# Altium schematic sheet ActiTouch_Receiver_Sheet1.SchDoc
size A4; SheetNumber: 5; SheetTotal: 6
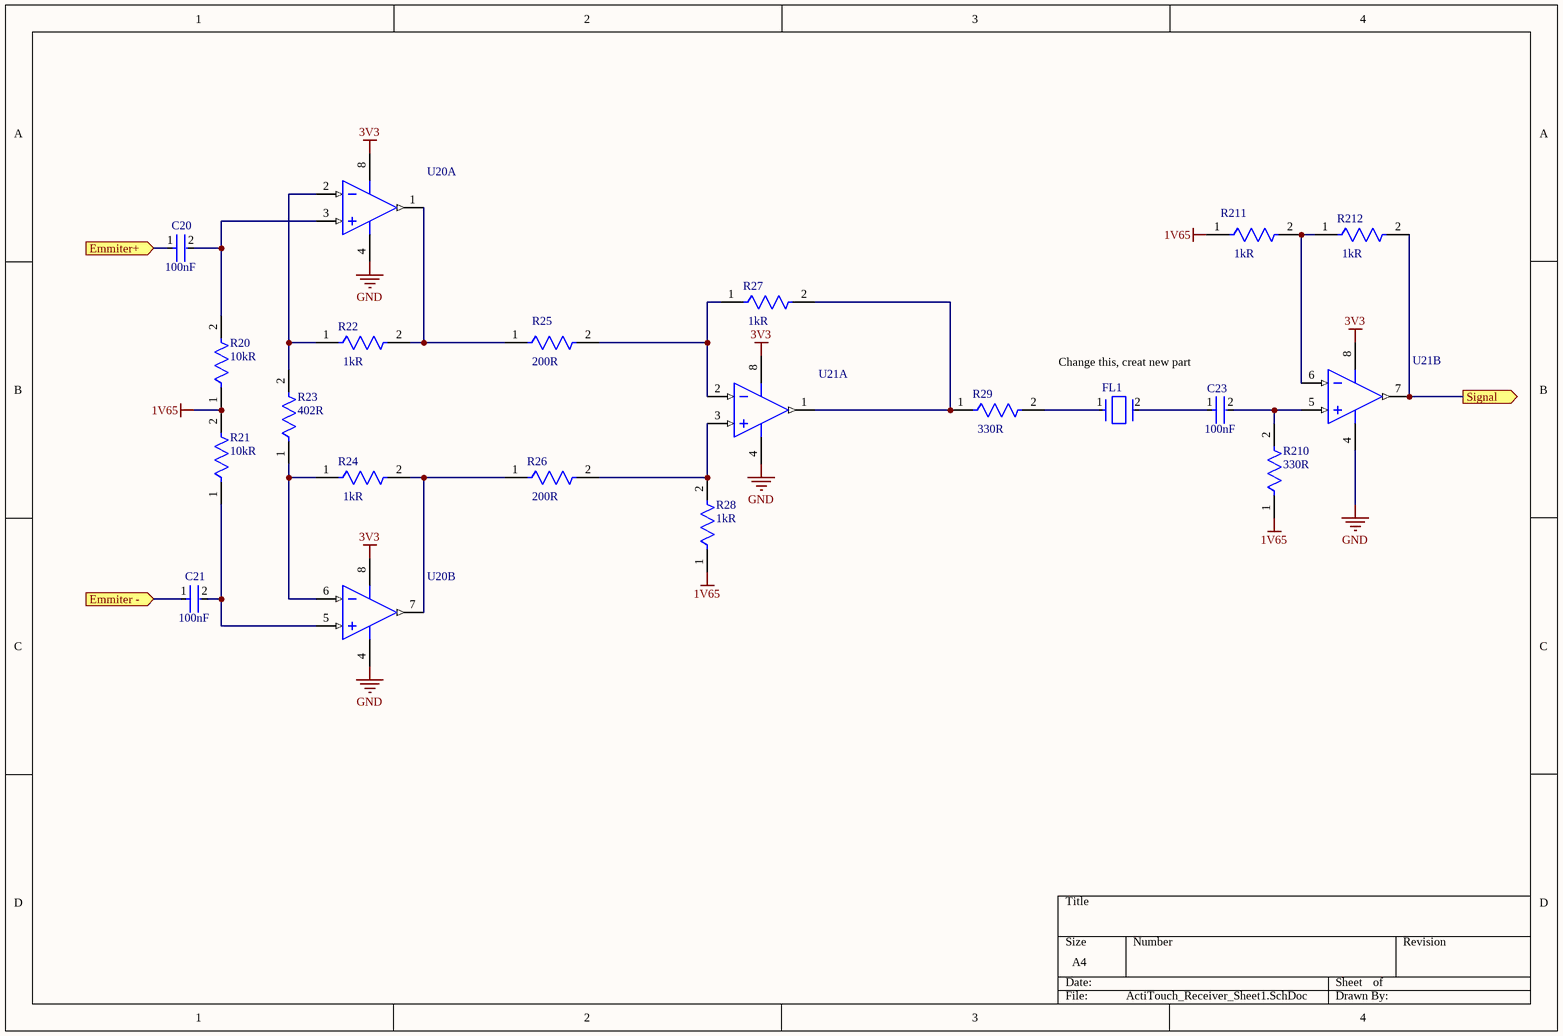
[diagram p0: ActiTouch_Receiver_Sheet1.SchDoc]

## Parts
C20  Capacitance: 100nF  [FP-0603-L_1_6_0_1-W_0_8_0-IPC_B]  (hidden comment: EMK107B7104KAHT)
C21  Capacitance: 100nF  [FP-0603-L_1_6_0_1-W_0_8_0-IPC_B]  (hidden comment: EMK107B7104KAHT)
C23  Capacitance: 100nF  [FP-0603-L_1_6_0_1-W_0_8_0-IPC_B]  (hidden comment: EMK107B7104KAHT)
FL1  CDSCB10M7GA121-R0  [FP-CDSCB10M7GA121-R0-MFG]  (value not drawn)
R20  Resistance: 10kR  [FP-RNCP0603-MFG]  (hidden comment: RNCP0603FTD10R0)
R21  Resistance: 10kR  [FP-RNCP0603-MFG]  (hidden comment: RNCP0603FTD10R0)
R22  Resistance: 1kR  [FP-RNCP0603-MFG]  (hidden comment: RNCP0603FTD10R0)
R23  Resistance: 402R  [FP-RNCP0603-MFG]  (hidden comment: RNCP0603FTD10R0)
R24  Resistance: 1kR  [FP-RNCP0603-MFG]  (hidden comment: RNCP0603FTD10R0)
R25  Resistance: 200R  [FP-RNCP0603-MFG]  (hidden comment: RNCP0603FTD10R0)
R26  Resistance: 200R  [FP-RNCP0603-MFG]  (hidden comment: RNCP0603FTD10R0)
R27  Resistance: 1kR  [FP-RNCP0603-MFG]  (hidden comment: RNCP0603FTD10R0)
R28  Resistance: 1kR  [FP-RNCP0603-MFG]  (hidden comment: RNCP0603FTD10R0)
R29  Resistance: 330R  [FP-RNCP0603-MFG]  (hidden comment: RNCP0603FTD10R0)
R210  Resistance: 330R  [FP-RNCP0603-MFG]  (hidden comment: RNCP0603FTD10R0)
R211  Resistance: 1kR  [FP-RNCP0603-MFG]  (hidden comment: RNCP0603FTD10R0)
R212  Resistance: 1kR  [FP-RNCP0603-MFG]  (hidden comment: RNCP0603FTD10R0)
U20  OPA2836IDR  [D0008A_M]  (value not drawn)  (parts A,B of 2)
U21  OPA2836IDR  [D0008A_M]  (value not drawn)  (parts A,B of 2)

## Ports
Emmiter - (in), Emmiter+ (in), Signal (out)

## Nets
1V65: R20.1 R21.2 R28.1 R210.1 R211.1
3V3: U20.8(VS+) U21.8(VS+)
GND: U20.4(VS-) U21.4(VS-)
Emmiter -: C21.1 ; port Emmiter -
Emmiter+: C20.1 ; port Emmiter+
Signal: R212.2 U21.7(VOUT2) ; port Signal
NetC20_2: C20.2 R20.2 U20.3(VIN1+)
NetC21_2: C21.2 R21.1 U20.5(VIN2+)
NetC23_1: C23.1 FL1.2
NetC23_2: C23.2 R210.2 U21.5(VIN2+)
NetFL1_1: FL1.1 R29.2
NetR22_1: R22.1 R23.2 U20.2(VIN1-)
NetR22_2: R22.2 R25.1 U20.1(VOUT1)
NetR23_1: R23.1 R24.1 U20.6(VIN2-)
NetR24_2: R24.2 R26.1 U20.7(VOUT2)
NetR25_2: R25.2 R27.1 U21.2(VIN1-)
NetR26_2: R26.2 R28.2 U21.3(VIN1+)
NetR27_2: R27.2 R29.1 U21.1(VOUT1)
NetR211_2: R211.2 R212.1 U21.6(VIN2-)

## Notes on the sheet
- Change this, creat new part

## Library data of the parts
C20 C21 C23 = CMP-14477-003798-2: None; Voltage Rating (DC): 16V; Tolerance: 10%; Package Quantity: 4000; Packaging: Tape and Reel; Lead Free: Lead Free; Voltage Rating: 16V; Halogen Free: Halogen Free; Case/Package: 0603
FL1 = CMP-06047-000004-1: Ceramic Filter 10.7MHz 2-Pin Surface Mount Emboss T/R
R20-R29 R210-R212 = CMP-26527-000751-1: 10Ω ±1% 0.125W 0603 High Power Anti-Sulfur Thin Film Chip Resistor; Temperature Coefficient: 100ppm/°C; Max Power Dissipation: 125mW; Case Code (Imperial): 0603; Case/Package: 0603; Tolerance: 1%; Features: Moisture Resistant; Width: 0.031inch; Series: RNCP; Lead Free: Lead Free; Max Operating Temperature: 155°C; Height: 0.02inch; Length: 0.059inch; Case Code (Metric): 1608; Min Operating Temperature: -55°C; Packaging: Tape and Reel; Resistor Type: Thin Film; RoHS Compliant: Yes; Mount: Surface Mount; Number of Terminations: 2
U20 U21 = CMP-0018-00293-2: Dual, Very Low Power, Rail to Rail Out, Negative Rail In, VFB Operational Amplifier, 2.5 to 5.5 V, -40 to 85 degC, 8-pin SOIC (D8), Green (RoHS & no Sb/Br); Manufacturer: Texas Instruments; Settling Time (0.1%)(Typ)(ns): 30; Iib(Max)(nA): 1000; Vio(Max)(mV): 0.4; Vs(Min)(V): 2.5; Vs(Max)(V): 5.5; Io(Typ)(mA): 50; Sub Family: High Output Current Amplifier (>=50mA), High Speed Amplifier (>=50MHz), Low Noise Amp (<=10nV/rtHz), Low Offset Voltage Amplifier (<=500uV), Low Supply Voltage Amplifier (<=2.7V); Vn at Flatband(Typ)(nV/rtHz): 4.6; Slew Rate(Typ)(V/us): 560; Number of Channels: 2; Iq per channel(Max)(mA): 1; BW @ Acl(MHz): 205; 3rd Harmonic(dBc): 105; 2nd Harmonic(dBc): 85; Mounting Technology: Surface Mount; ComponentLink3URL: http://www.ti.com/litv/pdf/msoi002j; ComponentLink1URL: http://www.ti.com/; DatasheetVersion: SLOS712D; Code_JEDEC: MS-012; PackageDescription: 8-Pin Plastic Small Outline, Body 4.9 x 3.9 mm, Pitch 1.27 mm; ComponentLink3Description: Package Specification; Eco-Plan: Green (RoHS & no Sb/Br); PackageReference: D0008A; PackageVersion: 4040047-3/M, 06/2011; PartNumber: OPA2836IDR; ComponentLink2Description: Datasheet; Acl, min stable gain(V/V): 1; ComponentLink1Description: Manufacturer URL; ComponentLink2URL: http://www.ti.com/general/docs/lit/getliterature.tsp?genericPartNumber=OPA2836&fileType=pdf